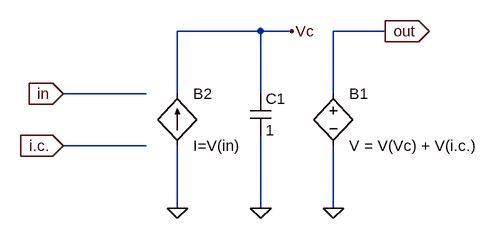
[diagram p0: schematic Integrator.asc]
Integrator.asc, the LTspice schematic file:
Version 4
SHEET 1 880 680
WIRE 320 32 192 32
WIRE 368 32 320 32
WIRE 512 32 432 32
WIRE 144 128 16 128
WIRE 192 128 192 32
WIRE 320 128 320 32
WIRE 432 128 432 32
WIRE 144 208 16 208
WIRE 192 304 192 208
WIRE 320 304 320 192
WIRE 432 304 432 208
FLAG 16 128 in
IOPIN 16 128 In
FLAG 432 304 0
FLAG 512 32 out
IOPIN 512 32 Out
FLAG 192 304 0
FLAG 320 304 0
FLAG 368 32 Vc
FLAG 16 208 i.c.
IOPIN 16 208 In
SYMBOL bv 432 112 R0
SYMATTR InstName B1
SYMATTR Value V = V(Vc) + V(i.c.)
SYMBOL bi2 192 128 R0
SYMATTR InstName B2
SYMATTR Value I=V(in)
SYMBOL cap 304 128 R0
SYMATTR InstName C1
SYMATTR Value 1

The netlist it stands for:
* Integrator.asc
B1 out 0 V = V(Vc) + V(i.c.)
B2 0 Vc I=V(in)
C1 Vc 0 1
.backanno
.end